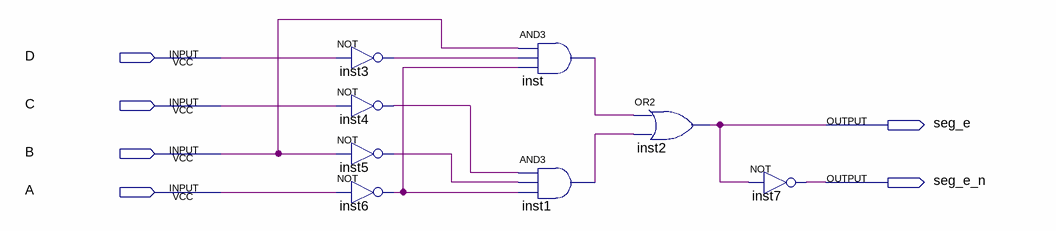
[diagram p0: schematic sheet]
// Quartus schematic segmento_e.bdf as structural Verilog: 8 symbols, 6 pins
module segmento_e (
  input  D,
  input  C,
  input  B,
  input  A,
  output seg_e,
  output seg_e_n
);

  wire inst1_out, inst3_out, inst4_out, inst5_out, inst6_out, inst_out;

  not inst3 (inst3_out, D);
  not inst4 (inst4_out, C);
  not inst5 (inst5_out, B);
  not inst6 (inst6_out, A);
  and inst (inst_out, B, inst3_out, inst6_out);
  and inst1 (inst1_out, inst4_out, inst5_out, inst6_out);
  or inst2 (seg_e, inst_out, inst1_out);
  not inst7 (seg_e_n, seg_e);
endmodule
